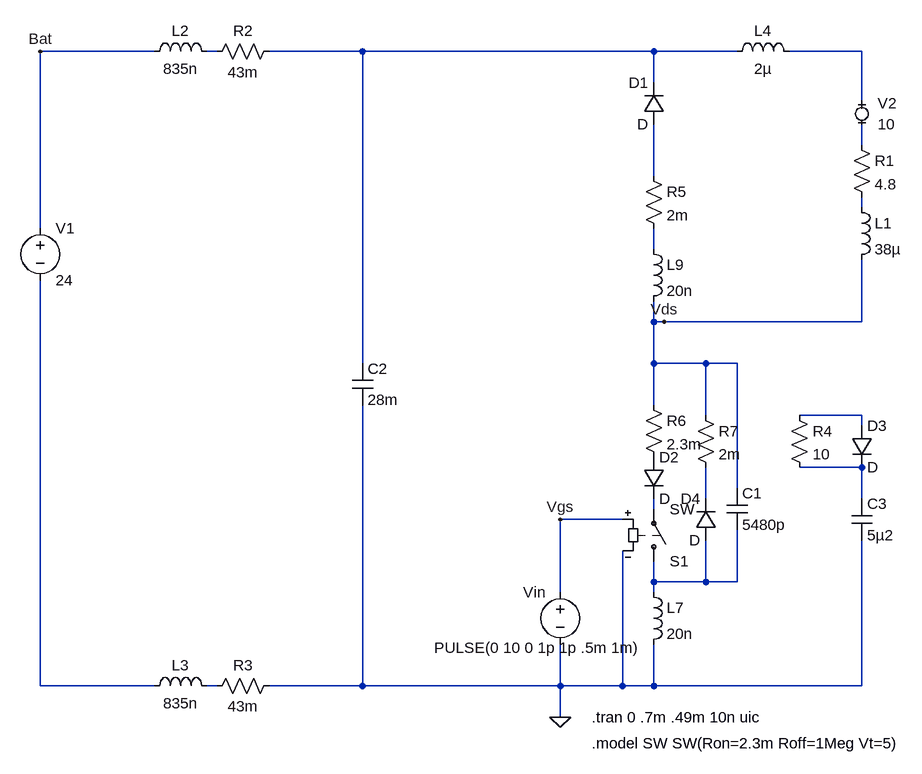
[diagram p0: schematic SWITCH_LC_.asc]
SWITCH_LC_.asc, the LTspice schematic file:
Version 4
SHEET 1 1624 680
WIRE -256 -432 -432 -432
WIRE -160 -432 -176 -432
WIRE 64 -432 -80 -432
WIRE 512 -432 64 -432
WIRE 640 -432 512 -432
WIRE 832 -432 720 -432
WIRE 512 -384 512 -432
WIRE 832 -352 832 -432
WIRE 832 -288 832 -320
WIRE 512 -240 512 -320
WIRE 832 -192 832 -208
WIRE -432 -160 -432 -432
WIRE 512 -128 512 -160
WIRE 512 -16 512 -48
WIRE 528 -16 512 -16
WIRE 832 -16 832 -112
WIRE 832 -16 528 -16
WIRE 64 48 64 -432
WIRE 512 48 512 -16
WIRE 592 48 512 48
WIRE 640 48 592 48
WIRE 512 112 512 48
WIRE 592 128 592 48
WIRE 832 128 736 128
WIRE 832 144 832 128
WIRE 832 208 736 208
WIRE 640 240 640 48
WIRE 592 256 592 208
WIRE 832 256 832 208
WIRE 512 272 512 256
WIRE 464 288 368 288
WIRE 512 384 512 352
WIRE 592 384 592 320
WIRE 592 384 512 384
WIRE 640 384 640 304
WIRE 640 384 592 384
WIRE 368 400 368 288
WIRE 512 400 512 384
WIRE -432 544 -432 -80
WIRE -256 544 -432 544
WIRE -160 544 -176 544
WIRE 64 544 64 112
WIRE 64 544 -80 544
WIRE 368 544 368 480
WIRE 368 544 64 544
WIRE 464 544 464 336
WIRE 464 544 368 544
WIRE 512 544 512 480
WIRE 512 544 464 544
WIRE 832 544 832 320
WIRE 832 544 512 544
WIRE 368 592 368 544
FLAG 368 592 0
FLAG 528 -16 Vds
FLAG 368 288 Vgs
FLAG -432 -432 Bat
SYMBOL ind 496 -144 R0
SYMATTR InstName L9
SYMATTR Value 20n
SYMBOL voltage 368 384 R0
WINDOW 123 0 0 Left 2
WINDOW 39 0 0 Left 2
WINDOW 0 -57 16 Left 2
WINDOW 3 -194 101 Left 2
SYMATTR InstName Vin
SYMATTR Value PULSE(0 10 0 1p 1p .5m 1m)
SYMBOL voltage -432 -176 R0
WINDOW 123 0 0 Left 2
WINDOW 39 24 124 Left 2
SYMATTR InstName V1
SYMATTR Value 24
SYMBOL ind 816 -208 R0
SYMATTR InstName L1
SYMATTR Value 38µ
SYMBOL res 816 -304 R0
SYMATTR InstName R1
SYMATTR Value 4.8
SYMBOL ind -272 -416 R270
WINDOW 0 32 56 VTop 2
WINDOW 3 5 56 VBottom 2
SYMATTR InstName L2
SYMATTR Value 835n
SYMBOL res -176 -416 R270
WINDOW 0 32 56 VTop 2
WINDOW 3 0 56 VBottom 2
SYMATTR InstName R2
SYMATTR Value 43m
SYMBOL ind -272 560 R270
WINDOW 0 32 56 VTop 2
WINDOW 3 5 56 VBottom 2
SYMATTR InstName L3
SYMATTR Value 835n
SYMBOL res -176 560 R270
WINDOW 0 32 56 VTop 2
WINDOW 3 0 56 VBottom 2
SYMATTR InstName R3
SYMATTR Value 43m
SYMBOL ind 624 -416 R270
WINDOW 0 32 56 VTop 2
WINDOW 3 5 56 VBottom 2
SYMATTR InstName L4
SYMATTR Value 2µ
SYMBOL ind 496 384 R0
SYMATTR InstName L7
SYMATTR Value 20n
SYMBOL cap 624 240 R0
SYMATTR InstName C1
SYMATTR Value 5480p
SYMBOL sw 512 368 M180
SYMATTR InstName S1
SYMBOL diode 528 -320 R180
WINDOW 0 24 64 Left 2
WINDOW 3 24 0 Left 2
SYMATTR InstName D1
SYMBOL diode 496 192 R0
SYMATTR InstName D2
SYMBOL cap 48 48 R0
SYMATTR InstName C2
SYMATTR Value 28m
SYMATTR SpiceLine Rser=2 Lser=10n
SYMBOL cap 816 256 R0
SYMATTR InstName C3
SYMATTR Value 5µ2
SYMBOL res 720 112 R0
SYMATTR InstName R4
SYMATTR Value 10
SYMBOL diode 816 144 R0
SYMATTR InstName D3
SYMBOL diode 608 320 R180
WINDOW 0 24 64 Left 2
WINDOW 3 24 0 Left 2
SYMATTR InstName D4
SYMBOL res 496 -256 R0
SYMATTR InstName R5
SYMATTR Value 2m
SYMBOL res 496 96 R0
SYMATTR InstName R6
SYMATTR Value 2.3m
SYMBOL res 576 112 R0
SYMATTR InstName R7
SYMATTR Value 2m
SYMBOL MiniSyms4\\voltage- 832 -336 R0
WINDOW 123 0 0 Left 2
WINDOW 39 0 0 Left 2
SYMATTR InstName V2
SYMATTR Value 10
TEXT 416 592 Left 2 !.tran 0 .7m .49m 10n uic
TEXT 416 632 Left 2 !.model SW SW(Ron=2.3m Roff=1Meg Vt=5)

The netlist it stands for:
* SWITCH_LC_.asc
L9 N007 Vds 20n
Vin Vgs 0 PULSE(0 10 0 1p 1p .5m 1m)
V1 Bat N013 24
L1 N006 Vds 38µ
R1 N004 N006 4.8
L2 Bat N001 835n
R2 N001 N002 43m
L3 N013 N014 835n
R3 N014 0 43m
L4 N002 N003 2µ
L7 N012 0 20n
C1 Vds N012 5480p
S1 N012 N011 Vgs 0 SW
D1 N005 N002 D
D2 P001 N011 D
C2 N002 0 28m Rser=2 Lser=10n
C3 N009 0 5µ2
R4 N008 N009 10
D3 N008 N009 D
D4 N012 N010 D
R5 N005 N007 2m
R6 Vds P001 2.3m
R7 Vds N010 2m
V2 N003 N004 10
.model D D
.lib standard.dio
.tran 0 .7m .49m 10n uic
.model SW SW(Ron=2.3m Roff=1Meg Vt=5)
.backanno
.end

* Results of the author's LTspice run, read from the files saved beside the schematic
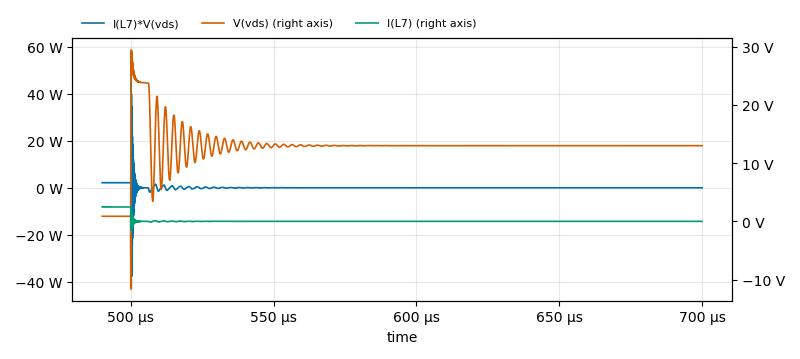
[diagram p1: Transient Analysis of SWITCH_LC_.asc, plotted from the saved traces]
* Transient Analysis, 1 run:
*   I(L7)*V(vds): min -42.97 W, max 58.46 W, average 105.5 mW, rms 1.622 W, last 163.2 µW
*   V(vds): min -11.59 V, max 29.38 V, average 12.76 V, rms 13.24 V, last 13 V
*   I(L7): min -1.581 A, max 2.482 A, average 118.5 mA, rms 545.7 mA, last 12.55 µA